# EasyEDA schematic SCH_MedicalIOT_2023-03-18.json

## Sheets
1 Sheet_1: TITLE: Sheet_1; REV: 1.0; Date: 2023-03-17; Sheet: 1/1; Drawn By: ramzanlabs; Company: Your Company
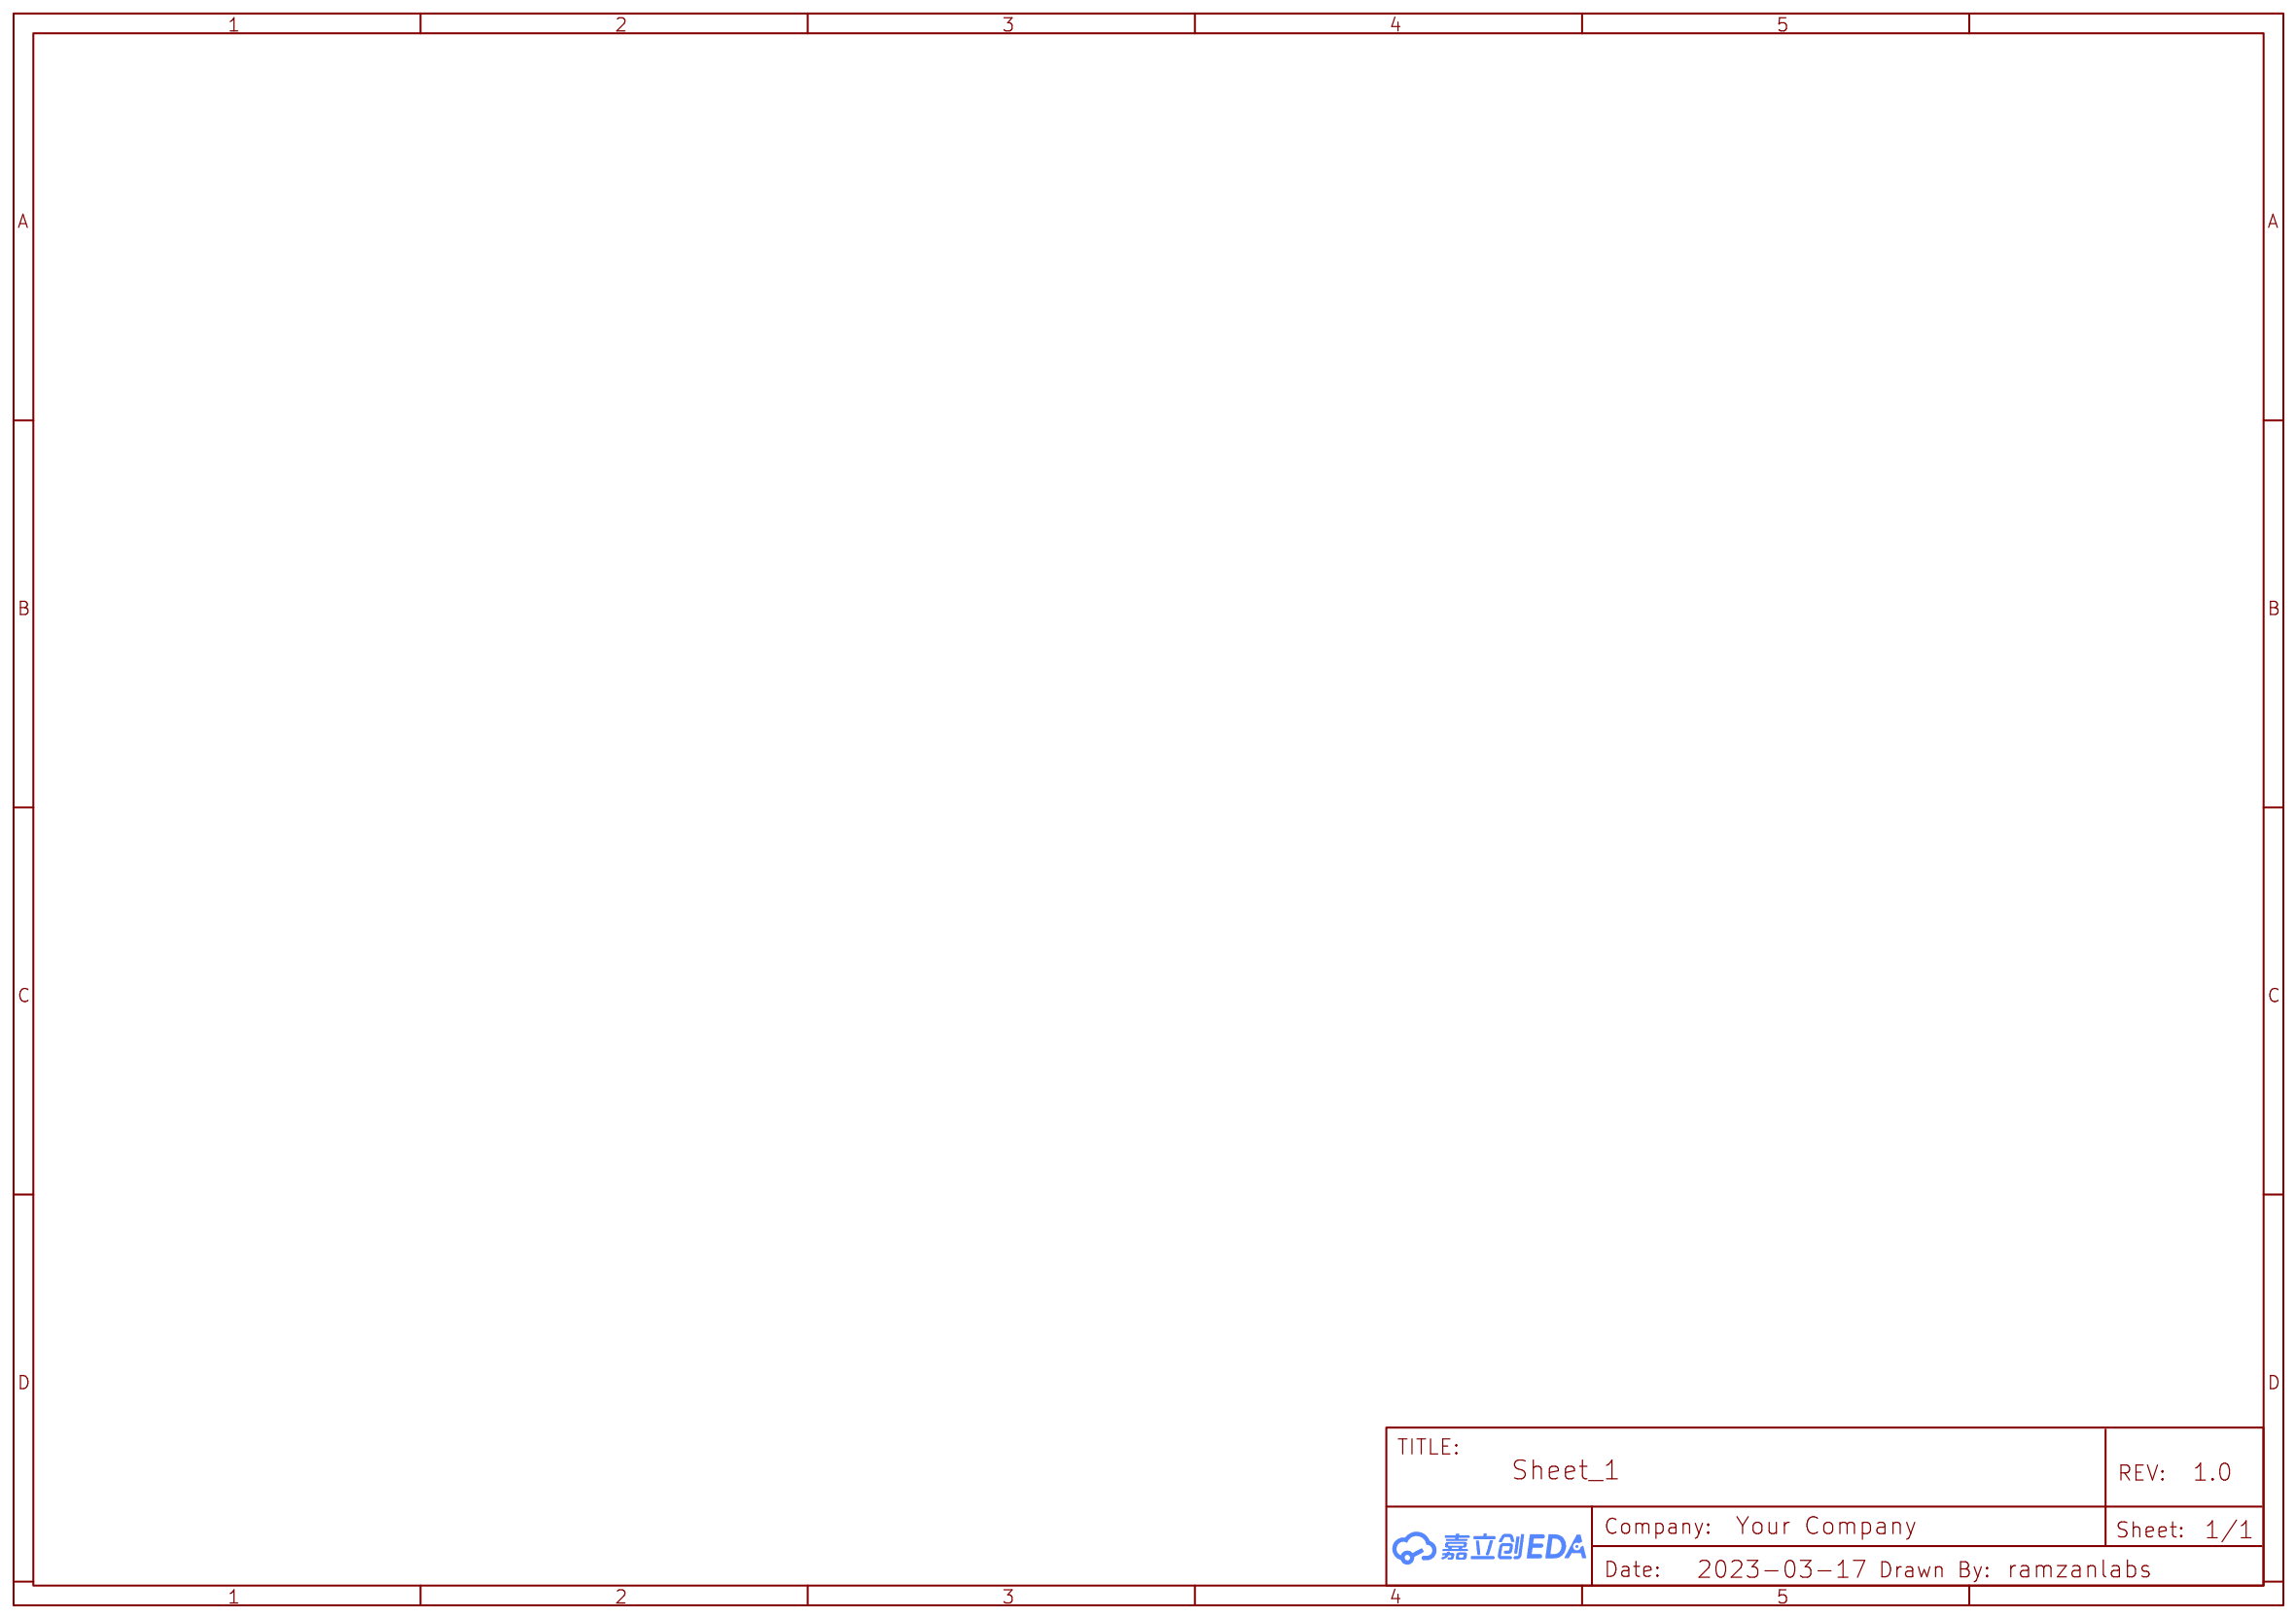
[diagram p0: Sheet_1]
2 Schematic: TITLE: ESP32-S2-Deveboard; Date: 2020-09-15; Drawn By: koendv; Company: Work In Progress
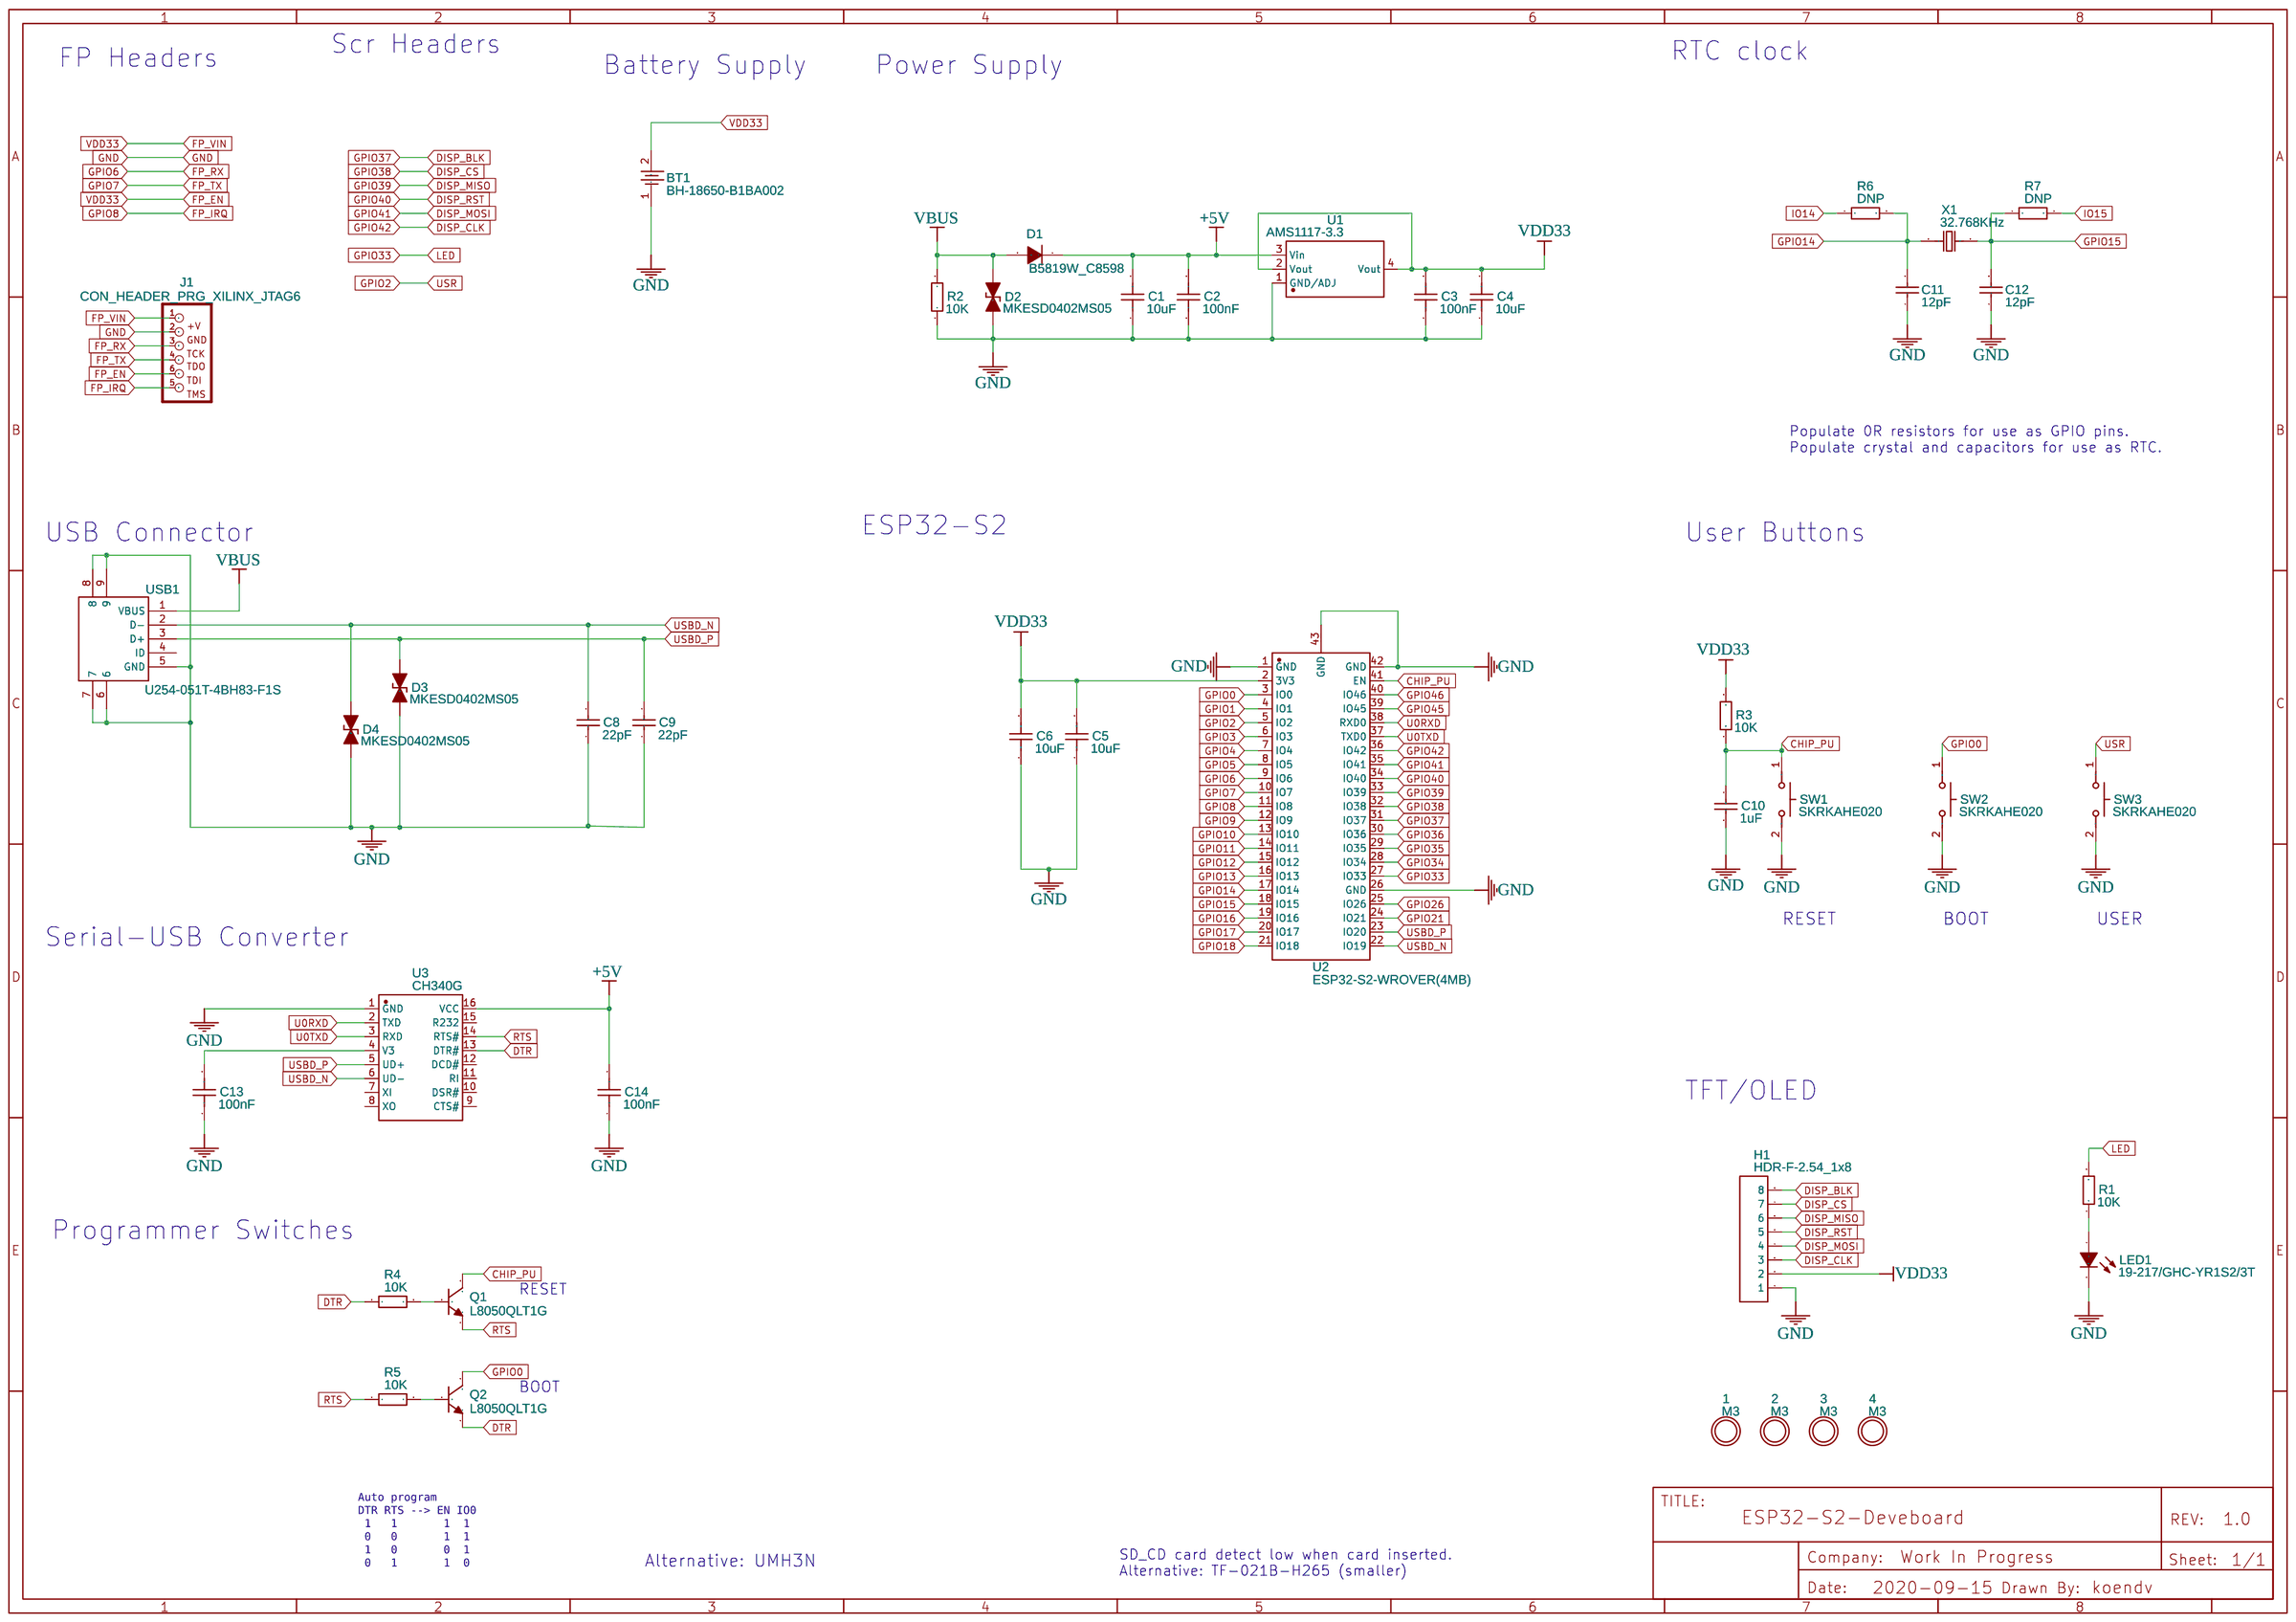
[diagram p1: Schematic]

## Parts
1  M3  [MOUNTINGHOLE_3.0_PLATEDTHIN]
2  M3  [MOUNTINGHOLE_3.0_PLATEDTHIN]
3  M3  [MOUNTINGHOLE_3.0_PLATEDTHIN]
4  M3  [MOUNTINGHOLE_3.0_PLATEDTHIN]
BT1  BH-18650-B1BA002  [BATTERY-SMD_18650-1S-L77.1-W20.7-1]
C1  10uF  [C0603]
C2  100nF  [C0603]
C3  100nF  [C0603]
C4  10uF  [C0603]
C5  10uF  [C0603]
C6  10uF  [C0603]
C8  22pF  [C0402]
C9  22pF  [C0402]
C10  1uF  [C0603]
C11  12pF  [C0402]
C12  12pF  [C0402]
C13  100nF  [C0603]
C14  100nF  [C0603]
D1  B5819W_C8598  [SOD-123_L2.8-W1.8-LS3.7-RD]
D2  MKESD0402MS05  [D0402-BI]
D3  MKESD0402MS05  [D0402-BI]
D4  MKESD0402MS05  [D0402-BI]
H1  HDR-F-2.54_1x8  [HDR-F-2.54_1X8]
J1  CON_HEADER_PRG_XILINX_JTAG6  [HEADER_PRG_1X06]
LED1  19-217/GHC-YR1S2/3T  [LED0603-R-RD]
Q1  L8050QLT1G  [SOT-23-3_L2.9-W1.3-P1.90-LS2.4-BR]
Q2  L8050QLT1G  [SOT-23-3_L2.9-W1.3-P1.90-LS2.4-BR]
R1  10K  [R0402]
R2  10K  [R0402]
R3  10K  [R0402]
R4  10K  [R0402]
R5  10K  [R0402]
R6  DNP  [R0402]
R7  DNP  [R0402]
SW1  SKRKAHE020  [SW-SMD_L3.9-W3.0-P4.45]
SW2  SKRKAHE020  [SW-SMD_L3.9-W3.0-P4.45]
SW3  SKRKAHE020  [SW-SMD_L3.9-W3.0-P4.45]
U1  AMS1117-3.3  [SOT-223-3_L6.5-W3.4-P2.30-LS7.0-BR]
U2  ESP32-S2-WROVER(4MB)  [WIFI-SMD_ESP32-S2-WROVER-I]
U3  CH340G  [SOIC-16_L9.9-W3.9-P1.27-LS6.0-BR]
USB1  U254-051T-4BH83-F1S  [MICRO-USB-SMD_U254-051T-4BH83-F1S]
X1  32.768KHz  [FC-135R_L3.2-W1.5]

## Library data of the parts
1-4 = MOUNTINGHOLE3.0THIN: Contributor: Adafruit
BT1 = BH-18650-B1BA002: Supplier: LCSC; Supplier Part: C2988620; Manufacturer: MYOUNG(美阳); link: https://atta.szlcsc.com/upload/public/pdf/source/20220402/870DB99AB50CA0DF8D51CF7C86A51FAB.pdf; Contributor: lcsc; JLCPCB Part Class: Extended Part
C1 C4-C6 = CL10A106KP8NNNC: Supplier: LCSC; Manufacturer: SAMSUNG; LCSC Assembly: Yes; Supplier Part: C19702; SMT Type: Basic
C2 C3 C13 C14 = CC0603KRX7R9BB104: Supplier: LCSC; Manufacturer: YAGEO; LCSC Assembly: Yes; Supplier Part: C14663; SMT Type: Basic
C8 C9 = 0402CG220J500NT: Supplier: LCSC; Manufacturer: FH; LCSC Assembly: Yes; Supplier Part: C1555; SMT Type: Basic
C10 = CL10A105KB8NNNC: Supplier: LCSC; Manufacturer: SAMSUNG; LCSC Assembly: Yes; Supplier Part: C15849; SMT Type: Basic
C11 C12 = 0402CG120J500NT: Supplier: LCSC; Manufacturer: FH; LCSC Assembly: Yes; Supplier Part: C1547; SMT Type: Basic
D1 = B5819W_C8598: Supplier: LCSC; Manufacturer: CJ; Manufacturer Part: B5819W; LCSC Assembly: Yes; image: //image.lceda.cn/szlcsc/C8598.jpg; Supplier Part: C8598; SMT Type: Basic
D2-D4 = MKESD0402MS05: Supplier: LCSC; Supplier Part: C379107; Manufacturer: MK; Contributor: LCSC; LCSC Assembly: Yes; SMT Type: Extend
H1 = HDR-F-2.54_1x8: Supplier Part: C225505; Supplier: LCSC; Contributor: LCEDA_Lib
J1 = CON_HEADER_PRG_XILINX_JTAG6: 6-pin Xilinx JTAG programming header; Contributor: DangerousPrototype
LED1 = 19-217/GHC-YR1S2/3T: Supplier: LCSC; Manufacturer: EVERLIGHT; LCSC Assembly: Yes; image: //image.lceda.cn/szlcsc/C72043.jpg; Supplier Part: C72043; SMT Type: Basic
Q1 Q2 = L8050QLT1G: Supplier: LCSC; Manufacturer: LRC; image: //image.lceda.cn/szlcsc/C49581.jpg; Supplier Part: C49581; LCSC Assembly: Yes; SMT Type: Extend
R1-R5 = 0402WGF1002TCE: Supplier: LCSC; Manufacturer: UniOhm; LCSC Assembly: Yes; Supplier Part: C25744; SMT Type: Basic
R6 R7 = 0402WGF0000TCE: Supplier: LCSC; Manufacturer: UniOhm; LCSC Assembly: Yes; Supplier Part: C17168; SMT Type: Basic
SW1-SW3 = SKRKAHE020: Supplier: LCSC; Supplier Part: C202388; Manufacturer: ALPS Electric; Contributor: LCSC
U1 = AMS1117-3.3: sourceId: dwIGgezVh; Supplier: LCSC; Manufacturer: AMS; LCSC Assembly: Yes; image: //image.lceda.cn/szlcsc/C6186.jpg; Supplier Part: C6186; SMT Type: Basic
U2 = ESP32-S2-WROVER(4MB): Supplier: LCSC; Supplier Part: C701333; Manufacturer: Espressif Systems; Contributor: LCSC
U3 = CH340G: Supplier: LCSC; Manufacturer: WCH; LCSC Assembly: Yes; image: //image.lceda.cn/szlcsc/C14267.jpg; Supplier Part: C14267; SMT Type: Basic
USB1 = U254-051T-4BH83-F1S: Supplier: LCSC; Supplier Part: C397452; Manufacturer: XKB Enterprise; Contributor: LCSC
X1 = Q13FC1350000400: Supplier: LCSC; Manufacturer: EPSON; LCSC Assembly: Yes; Supplier Part: C32346; SMT Type: Basic

## Nets
+5V: C1.2 C2.2 C14.2 D1.1(-) U1.3(Vin) U3.16(VCC)
GND: BT1.1 C1.1 C2.1 C3.1 C4.1 C5.1 C6.1 C8.1 C9.1 C10.1 C11.1 C12.1 C13.1 C14.1 D2.1 D3.1 D4.1 H1.1 J1.2(GND) LED1.2(C) R2.1 SW1.2 SW2.2 SW3.2 U1.1(GND/ADJ) U2.1(GND) U2.26(GND) U2.42(GND) U2.43(GND) U3.1(GND) USB1.5(GND) USB1.6 USB1.7 USB1.8 USB1.9
VBUS: D1.2(+) D2.2 R2.2 USB1.1(VBUS)
CHIP_PU: C10.2 Q1.3(C) R3.1 SW1.1 U2.41(EN)
DISP_BLK: H1.8 U2.31(IO37)
DISP_CLK: H1.3 U2.36(IO42)
DISP_CS: H1.7 U2.32(IO38)
DISP_MISO: H1.6 U2.33(IO39)
DISP_MOSI: H1.4 U2.35(IO41)
DISP_RST: H1.5 U2.34(IO40)
DTR: Q2.2(E) R4.1 U3.13(DTR#)
FP_EN: BT1.2 C3.2 C4.2 C5.2 C6.2 H1.2 J1.1(+V) J1.6(TDI) R3.2 U1.2(Vout) U1.4(Vout) U2.2(3V3)
FP_IRQ: J1.5(TMS) U2.11(IO8)
FP_RX: J1.3(TCK) U2.9(IO6)
FP_TX: J1.4(TDO) U2.10(IO7)
GPIO0: Q2.3(C) SW2.1 U2.3(IO0)
GPIO1: U2.4(IO1)
GPIO2: SW3.1 U2.5(IO2)
GPIO3: U2.6(IO3)
GPIO4: U2.7(IO4)
GPIO5: U2.8(IO5)
GPIO9: U2.12(IO9)
GPIO10: U2.13(IO10)
GPIO11: U2.14(IO11)
GPIO12: U2.15(IO12)
GPIO13: U2.16(IO13)
GPIO14: C11.2 R6.2 U2.17(IO14) X1.1
GPIO15: C12.2 R7.1 U2.18(IO15) X1.2
GPIO16: U2.19(IO16)
GPIO17: U2.20(IO17)
GPIO18: U2.21(IO18)
GPIO21: U2.24(IO21)
GPIO26: U2.25(IO26)
GPIO33: R1.2 U2.27(IO33)
GPIO34: U2.28(IO34)
GPIO35: U2.29(IO35)
GPIO36: U2.30(IO36)
GPIO45: U2.39(IO45)
GPIO46: U2.40(IO46)
IO14: R6.1
IO15: R7.2
RTS: Q1.2(E) R5.1 U3.14(RTS#)
U0RXD: U2.38(RXD0) U3.2(TXD)
U0TXD: U2.37(TXD0) U3.3(RXD)
USBD_N: C8.2 D4.2 U2.22(IO19) U3.6(UD-) USB1.2(D-)
USBD_P: C9.2 D3.2 U2.23(IO20) U3.5(UD+) USB1.3(D+)
Net-(C13-2): C13.2 U3.4(V3)
Net-(LED1-1): LED1.1(A) R1.1
Net-(Q1-1): Q1.1(B) R4.2
Net-(Q2-1): Q2.1(B) R5.2

Not connected (* = marked no-connect by the designer): U3 7(XI) 8(XO) 9(CTS#) 10(DSR#) 11(RI) 12(DCD#) 15(R232); USB1 4(ID)

## Notes on the sheets
sheet 2
- Scr Headers
- FP Headers
- RTC clock
- Battery Supply
- Power Supply
- Populate 0R resistors for use as GPIO pins.
  Populate crystal and capacitors for use as RTC.
- USB Connector
- ESP32-S2
- User Buttons
- RESET
- BOOT
- USER
- Serial-USB Converter
- TFT/OLED
- Programmer Switches
- RESET
- BOOT
- Auto program
  DTR RTS --> EN IO0
   1   1       1  1
   0   0       1  1
   1   0       0  1
   0   1       1  0
- SD_CD card detect low when card inserted.
  Alternative: TF-021B-H265 (smaller)
- Alternative: UMH3N
